# Altium schematic sheet 9_Airframe-Wireless.SchDoc
size A3; SheetNumber: 9; SheetTotal: 9
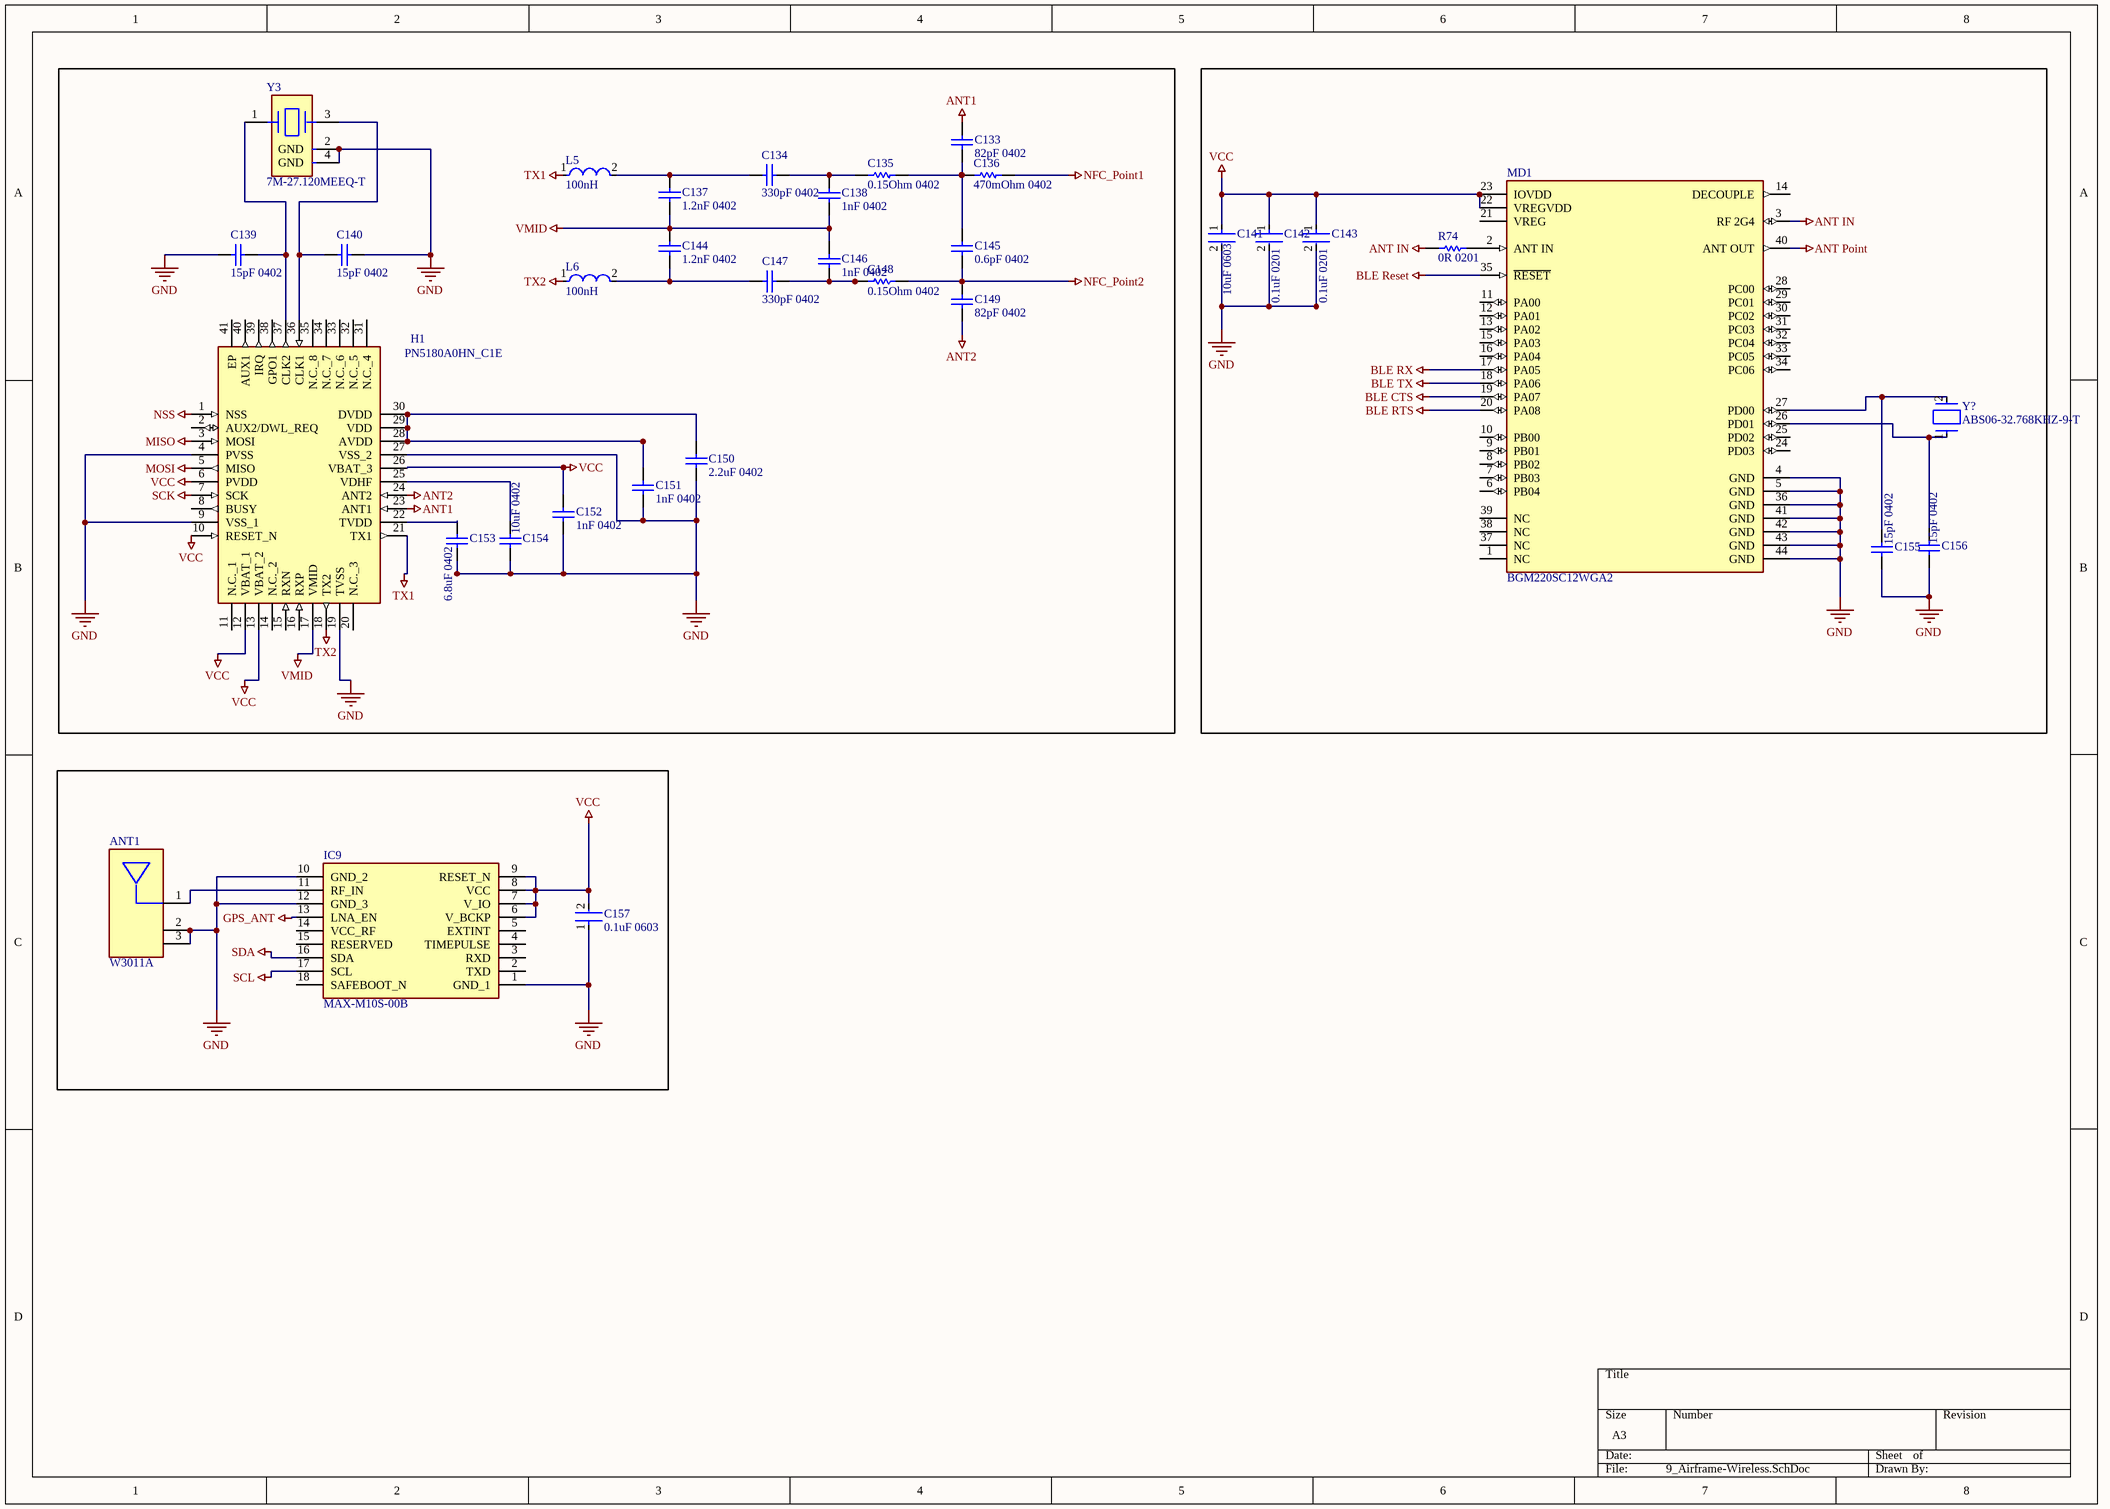
[diagram p0: 9_Airframe-Wireless.SchDoc]

## Parts
ANT1  W3011A  [FP-W3011A-MFG]
C133  82pF 0402  [CAPC1005X55X25ML5T10]
C134  330pF 0402  [CAPC1005X55X25ML5T10]
C135  0.15Ohm 0402  [RESC1608X55X25ML10T15]
C136  470mOhm 0402  [RESC1608X55X25ML10T15]
C137  1.2nF 0402  [CAPC1005X55X25ML5T10]
C138  1nF 0402  [CAPC1005X55X25ML5T10]
C139  15pF 0402  [CAPC1005X55X25ML5T10]
C140  15pF 0402  [CAPC1005X55X25ML5T10]
C141  10uF 0603  [FP-GRM188-0_2-IPC_C]
C142  0.1uF 0201  [FP-C0603-030-0_03-IPC_C]
C143  0.1uF 0201  [FP-C0603-030-0_03-IPC_C]
C144  1.2nF 0402  [CAPC1005X55X25ML5T10]
C145  0.6pF 0402  [CAPC1005X55X25ML5T10]
C146  1nF 0402  [CAPC1005X55X25ML5T10]
C147  330pF 0402  [CAPC1005X55X25ML5T10]
C148  0.15Ohm 0402  [RESC1608X55X25ML10T15]
C149  82pF 0402  [CAPC1005X55X25ML5T10]
C150  2.2uF 0402  [CAPC1005X55X25ML5T10]
C151  1nF 0402  [CAPC1005X55X25ML5T10]
C152  1nF 0402  [CAPC1005X55X25ML5T10]
C153  6.8uF 0402  [CAPC1005X55X25ML5T10]
C154  10uF 0402  [CAPC1005X55X25ML5T10]
C155  15pF 0402  [CAPC1005X55X25ML5T10]
C156  15pF 0402  [CAPC1005X55X25ML5T10]
C157  0.1uF 0603  [FP-C0603C-CF-MFG]
H1  PN5180A0HN_C1E  [QFN50P600X600X100-41N-D]
IC9  MAX-M10S-00B  [MAXM10S00B]
L5  100nH  [FP-LQM18NN_00-IPC_C]
L6  100nH  [FP-LQM18NN_00-IPC_C]
MD1  BGM220SC12WGA2  [FP-BGM220SC12WGA2-MFG]
R74  0R 0201  [RESC0603X28X15NL05T05]
Y3  7M-27.120MEEQ-T  [FP-7M-MFG]
Y?  ABS06-32.768KHZ-9-T  [FP-ABS06-MFG]

## Nets
ANT1: C133.1 H1.23(ANT1)
ANT2: C149.2 H1.24(ANT2)
ANT IN: MD1.3(RF_2G4) R74.2
ANT Point: MD1.40(ANT_OUT)
BLE CTS: MD1.19(PA07)
BLE Reset: MD1.35(~{RESET})
BLE RTS: MD1.20(PA08)
BLE RX: MD1.17(PA05)
BLE TX: MD1.18(PA06)
GND: ANT1.2(GND) ANT1.3(GND) C139.1 C140.2 C141.2 C142.2 C143.2 C150.2 C151.2 C152.2 C153.2 C154.2 C155.1 C156.1 C157.1 H1.4(PVSS) H1.9(VSS_1) H1.19(TVSS) H1.27(VSS_2) IC9.1(GND_1) IC9.10(GND_2) IC9.12(GND_3) MD1.4(GND) MD1.5(GND) MD1.36(GND) MD1.41(GND) MD1.42(GND) MD1.43(GND) MD1.44(GND) Y3.2(GND) Y3.4(GND)
GPS_ANT: IC9.13(LNA_EN)
MISO: H1.3(MOSI)
MOSI: H1.5(MISO)
NFC_Point1: C136.1
NFC_Point2: C145.2 C148.1 C149.1
NSS: H1.1(NSS)
SCK: H1.7(SCK)
SCL: IC9.17(SCL)
SDA: IC9.16(SDA)
TX1: H1.21(TX1) L5.1
TX2: H1.18(TX2) L6.1
VCC: C141.1 C142.1 C143.1 C152.1 C157.2 H1.6(PVDD) H1.10(RESET_N) H1.12(VBAT_1) H1.13(VBAT_2) H1.26(VBAT_3) IC9.6(V_BCKP) IC9.7(V_IO) IC9.8(VCC) IC9.9(RESET_N) MD1.22(VREGVDD) MD1.23(IOVDD)
VMID: C137.2 C138.1 C144.1 C146.2 H1.17(VMID)
NetANT1_1: ANT1.1(Feed) IC9.11(RF_IN)
NetC133_2: C133.2 C135.1 C136.2 C145.1
NetC134_1: C134.1 C137.1 L5.2
NetC134_2: C134.2 C135.2 C138.2
NetC139_2: C139.2 H1.37(CLK2) Y3.1
NetC140_1: C140.1 H1.36(CLK1) Y3.3
NetC144_2: C144.2 C147.1 L6.2
NetC146_1: C146.1 C147.2 C148.2
NetC150_1: C150.1 C151.1 H1.28(AVDD) H1.29(VDD) H1.30(DVDD)
NetC153_1: C153.1 H1.22(TVDD)
NetC154_1: C154.1 H1.25(VDHF)
NetC155_2: C155.2 MD1.27(PD00) Y?.2
NetC156_2: C156.2 MD1.26(PD01) Y?.1
NetMD1_2: MD1.2(ANT_IN) R74.1

Not connected (* = marked no-connect by the designer): H1 2(AUX2/DWL_REQ) 8(BUSY) 11(N.C._1) 14(N.C._2) 15(RXN) 16(RXP) 20(N.C._3) 31(N.C._4) 32(N.C._5) 33(N.C._6) 34(N.C._7) 35(N.C._8) 38(GPO1) 39(IRQ) 40(AUX1) 41(EP); IC9 2(TXD) 3(RXD) 4(TIMEPULSE) 5(EXTINT) 14(VCC_RF) 15(RESERVED) 18(SAFEBOOT_N); MD1 1(NC) 6(PB04) 7(PB03) 8(PB02) 9(PB01) 10(PB00) 11(PA00) 12(PA01) 13(PA02) 14(DECOUPLE) 15(PA03) 16(PA04) 21(VREG) 24(PD03) 25(PD02) 28(PC00) 29(PC01) 30(PC02) 31(PC03) 32(PC04) 33(PC05) 34(PC06) 37(NC) 38(NC) 39(NC)

## Library data of the parts
ANT1 = CMP-16379-000002-1: RF ANT 1.575GHZ CHIP SOLDER SMD; Manufacturer: PulseLarsen Antennas; Bandwidth: 1559-1606.6MHz; Number Of Bands: 1; Max Frequency: 1606.6MHz; Impedance: 50Ω; Return Loss: -6/-7/-10dB; Gain: 1.8dB; Power Rating: 2W; Octopart: https://octopart.com/w3011a-pulse-10684180; Temperature Range Low: -40°C; Temperature Range High: +85°C; Height: 1.3mm; ComponentLink2URL: https://www.pulseelectronics.com/docs/library/W3011.pdf; Device Class L2: RF Semiconductors and Devices; ComponentLink2Description: Datasheet; Automotive: No; Device Class L3: RF Antennas; RoHS: TRUE; Digikey Description: RF ANT 1.575GHZ CHIP SOLDER SMD; Package: W3011A; Lead Free: Yes; Manufacturer Part Number: W3011A; Temperature: -40°C to +85°C; Category: Ant; Device Class L1: Integrated Circuits (ICs)
C133 C134 C137 C139 C140 C144 C145 C147 C149 C150 C153-C156 = CMP-1662-00017-1: Chip Capacitor, 1 nF, +/- 10%, 50 V, -55 to 125 degC, 0402 (1005 Metric), RoHS, Tape and Reel; Case\/Package: 0402; Type (Capacitors): X7R; Voltage Rating (DC): 50 V; Capacitance: 1 nF; Width: 0.5 mm; Pins: 2; REACH SVHC: No SVHC; Length: 1 mm; Height: 0.5 mm; PackageDescription: 2-Pin Surface Mount Device, Body 1 x 0.5 mm; DatasheetVersion: 07/2016; Mount: Surface Mount; ComponentLink2Description: Datasheet; Tolerance: 10%; ComponentLink2URL: http://psearch.en.murata.com/capacitor/product/GRM155R71H102KA01%23.pdf; ComponentLink1URL: http://www.murata.com/; Case Code (Metric): 1005; Package Quantity: 10000; Min Operating Temperature: -55 degC; Max Operating Temperature: 125 degC; Voltage Rating: 50 V; ComponentLink1Description: Manufacturer URL; Packaging: Tape and Reel; Radiation Hardening: No; RoHSCompliant: true; PackageReference: 0402; Mounting Technology: Surface Mount; Case Code (Imperial): 0402
C135 C136 C148 = CMP-2100-03667-1: Chip Resistor, 0 Ohm, +/- 5%, 0.1 W, -55 to 155 degC, 0603 (1608 Metric), RoHS, Tape and Reel; Manufacturer: Yageo; Temperature Coefficient: 200ppm/degreesC; Voltage Rating: 50V; Power Rating: 100mW; Resistance: 0mOhm; Width: 0.8mm; Max Operating Temperature: 155degC; Tolerance: 5%; Package Reference: 0603; Height: 0.45mm; Depth: 0.8mm; Package Description: 2-Pin Surface Mount Device, Body 1.6 x 0.8 mm; Termination: SMD/SMT; Package Quantity: 5000; Case/Package: 0603; Case Code (Imperial): 0603; Radiation Hardening: No; Number of Pins: 2; Length: 1.6mm; Lead Free: LeadFree; Voltage Rating (DC): 50V; Military Standard: Not; Datasheet URL: http://www.yageo.com/NewPortal/yageodocoutput?fileName=/pdf/R-Chip/PYu-RC_Group_51_RoHS_L_5.pdf; Manufacturer URL: http://www.yageo.com/; Packaging: TapeandReel; Case Code (Metric): 1608; Min Operating Temperature: -55degC; Composition: ThickFilm; RoHSCompliant: true; Contact Plating: Tin; Datasheet Version: Rev. 5, 10/2016; REACH SVHC: NoSVHC
C138 C146 C151 C152 = CMP-1662-00017-1: Chip Capacitor, 1 nF, +/- 10%, 50 V, -55 to 125 degC, 0402 (1005 Metric), RoHS, Tape and Reel; Case\/Package: 0402; Type (Capacitors): X7R; Voltage Rating (DC): 50 V; Width: 0.5 mm; Pins: 2; REACH SVHC: No SVHC; Length: 1 mm; Height: 0.5 mm; PackageDescription: 2-Pin Surface Mount Device, Body 1 x 0.5 mm; DatasheetVersion: 07/2016; Mount: Surface Mount; ComponentLink2Description: Datasheet; Tolerance: 10%; ComponentLink2URL: http://psearch.en.murata.com/capacitor/product/GRM155R71H102KA01%23.pdf; ComponentLink1URL: http://www.murata.com/; Case Code (Metric): 1005; Package Quantity: 10000; Min Operating Temperature: -55 degC; Max Operating Temperature: 125 degC; Capacitance: 1 nF; Voltage Rating: 50 V; ComponentLink1Description: Manufacturer URL; Packaging: Tape and Reel; Radiation Hardening: No; RoHSCompliant: true; PackageReference: 0402; Mounting Technology: Surface Mount; Case Code (Imperial): 0402
C141 = CMP-2000-06337-3: Chip Multilayer Ceramic Capacitors for General Purpose, 0603, 22uF, X5R, 15%, 20%, 10V; Tolerance: 20%; Weight: 0.000222oz; Material: Ceramic; Depth: 0.8mm; Length: 1.6mm; Termination: SMD/SMT; Capacitance: 22uF; Packaging: Tape and Reel; Width: 0.8mm; Voltage Rating: 10V; Case Code (Imperial): 0603; Mount: Surface Mount; Voltage Rating (DC): 10V; Case/Package: 0603; Thickness: 0.039inch; REACH SVHC: No SVHC; Dielectric: X5R; Height: 0.8mm; Package Quantity: 4000; Case Code (Metric): 1608; Min Operating Temperature: -55°C; Lead Free: Lead Free; Max Operating Temperature: 85°C
C142 C143 = CMP-08246-007095-1: Multilayer Ceramic Capacitors 220nF ±10% 6.3V X6S SMD 0201; Dielectric: X6S; Resistor Type: Ceramic; Length: 0.6mm; Capacitance: 220nF; Case Code (Metric): 0603; Series: C; Width: 0.012inch; Height: 0.3mm; Voltage Rating: 6.3V; Max Operating Temperature: 105°C; REACH SVHC: No SVHC; RoHS Compliant: Yes; Tolerance: 10%; Termination: SMD/SMT; Case/Package: 0201; Case Code (Imperial): 0201; Weight: 6E-06oz; Lead Free: Lead Free; Construction: Flat; Thickness: 300um; Mount: Surface Mount; Dielectric Material: Ceramic; Voltage Rating (DC): 6.3V; Packaging: Cut Tape; Package Quantity: 1; Min Operating Temperature: -55°C; Depth: 0.3mm
C157 = CMP-2006-03061-2: CAP CER 0.1UF 50V X7R 0603; Manufacturer: KEMET; Manufacturer Part Number: C0603C104K5RACTU; Tolerance: 0.1; Temperature Coefficient: 30ppm/°C; Material: Ceramic; Automotive Grade: Grade 1; Value: 0.10 μF; Temperature: -55°C to +125°C; RoHS: TRUE; Temperature Range High: +125°C; Lead Free: Yes; Octopart: https://octopart.com/c0603c104k5ractu-kemet-139244; Digikey Description: CAP CER 0.1UF 50V X7R 0603; Category: Cap; Package: C0603C-CF; ComponentLink2Description: Datasheet; Temperature Range Low: -55°C; Device Class L1: Passive Components; Voltage Rating: 50 V; Automotive: Yes; Device Class L3: Ceramic Capacitors; ComponentLink2URL: https://api.kemet.com/component-edge/download/datasheet/C0603C100J5GACAUTO.pdf; Capacitance: 0.10 μF; Device Class L2: Capacitors; Temperature Characteristic: X7R; Height: 0.87mm
H1 = PN5180A0HN_C1E: Hardware; Manufacturer_Name: NXP; Manufacturer_Part_Number: PN5180A0HN/C1E; Datasheet Link: https://datasheet.datasheetarchive.com/originals/distributors/DKDS42/DSANUWW0047957.pdf; Height: 1mm; Mouser Part Number: 771-PN5180A0HN/C1E; Mouser Price/Stock: https://www.mouser.co.uk/ProductDetail/NXP-Semiconductors/PN5180A0HN-C1E?qs=ycOx5YLpuFVFXy2iTiMBHA%3D%3D; Arrow Part Number: PN5180A0HN/C1E; Arrow Price/Stock: https://www.arrow.com/en/products/pn5180a0hnc1e/nxp-semiconductors?region=nac
IC9 = MAX-M10S-00B: Integrated Circuit; Manufacturer_Name: U-Blox; Datasheet Link: https://content.u-blox.com/sites/default/files/MAX-M10S_IntegrationManual_UBX-20053088.pdf; Height: 2.7mm; Manufacturer_Part_Number: MAX-M10S-00B; Mouser Part Number: 377-MAX-M10S-00B; Mouser Price/Stock: https://www.mouser.co.uk/ProductDetail/u-blox/MAX-M10S-00B?qs=A6eO%252BMLsxmT0PfQYPb7LLQ%3D%3D
L5 L6 = CMP-06042-014173-1: Multilayer Type Inductor for General Circuits, 0603 (1608), 100nH, 10%, 0.5Ω, 50mA; Shielding: Shielded; Self Resonant Frequency: 240MHz; Core Material: Ferrite; Resistance: 500mR; Q Factor: 15; Test Frequency: 25MHz; Height - Seated (Max): 0.035inch; Termination: SMD/SMT; Tolerance: 10%; Depth: 0.95mm; Current Rating: 50mA; Packaging: Tape and Reel; Military Standard: Not; REACH SVHC: No SVHC; Max Operating Temperature: 85°C; Radiation Hardening: No; Length: 1.6mm; Inductance Tolerance: 10%; Inductance: 100nH; Case Code (Imperial): 0603; Min Operating Temperature: -40°C; Number of Pins: 2; DC Resistance (DCR): 500mR; Width: 0.031inch; Height: 0.8mm; Max DC Current: 50mA; Case/Package: 0603; Package Quantity: 4000; Mount: Surface Mount; Lead Free: Lead Free; DC Current: 50mA; Case Code (Metric): 1608
MD1 = CMP-08140-000024-1: WIRELESS GECKO, BLUETOOTH SIP MO
R74 = CMP-2004-00006-1: Manufacturer: Vishay; Part Number: CRCW0201100RFNED
Y3 = CMP-2000-05695-2: Crystal 27.12MHz, 10ppm, 10pF, 50Ω; ESR (Equivalent Series Resistance): 60R; Termination: SMD/SMT; Min Operating Temperature: -10°C; Height: 0.031inch; Case/Package: SMD/SMT; Package Quantity: 3000; Width: 2.5mm; Max Operating Temperature: 70°C; Mount: Surface Mount; Series: 7M; Depth: 2.5mm; REACH SVHC: No SVHC; Packaging: Tape and Reel; Frequency Tolerance: 10ppm; Tolerance: 10ppm; Frequency: 27.12MHz; Load Capacitance: 10pF; Lead Free: Lead Free; Frequency Stability: 10ppm; Length: 3.2mm
Y? = CMP-27762-015421-1: Crystal 32.768kHz ±20ppm (Tol) 9pF FUND 90kΩ 2-Pin Mini-CSMD T/R; ESR (Equivalent Series Resistance): 90kR; Max Operating Temperature: 85°C; Frequency Tolerance: 20ppm; Case/Package: CSMD; Termination: SMD/SMT; RoHS Compliant: Yes; Height: 0.6mm; Load Capacitance: 9pF; Packaging: Tape and Reel; Depth: 1.2mm; Tolerance: 20ppm; Frequency: 32.768kHz; Series: ABS06; Width: 1.2mm; Length: 2mm; Number of Pins: 2; Min Operating Temperature: -40°C; Mount: Surface Mount; Lead Free: Lead Free; Package Quantity: 3000